# EAGLE design badge_buttons (EAGLE 9.0.1)
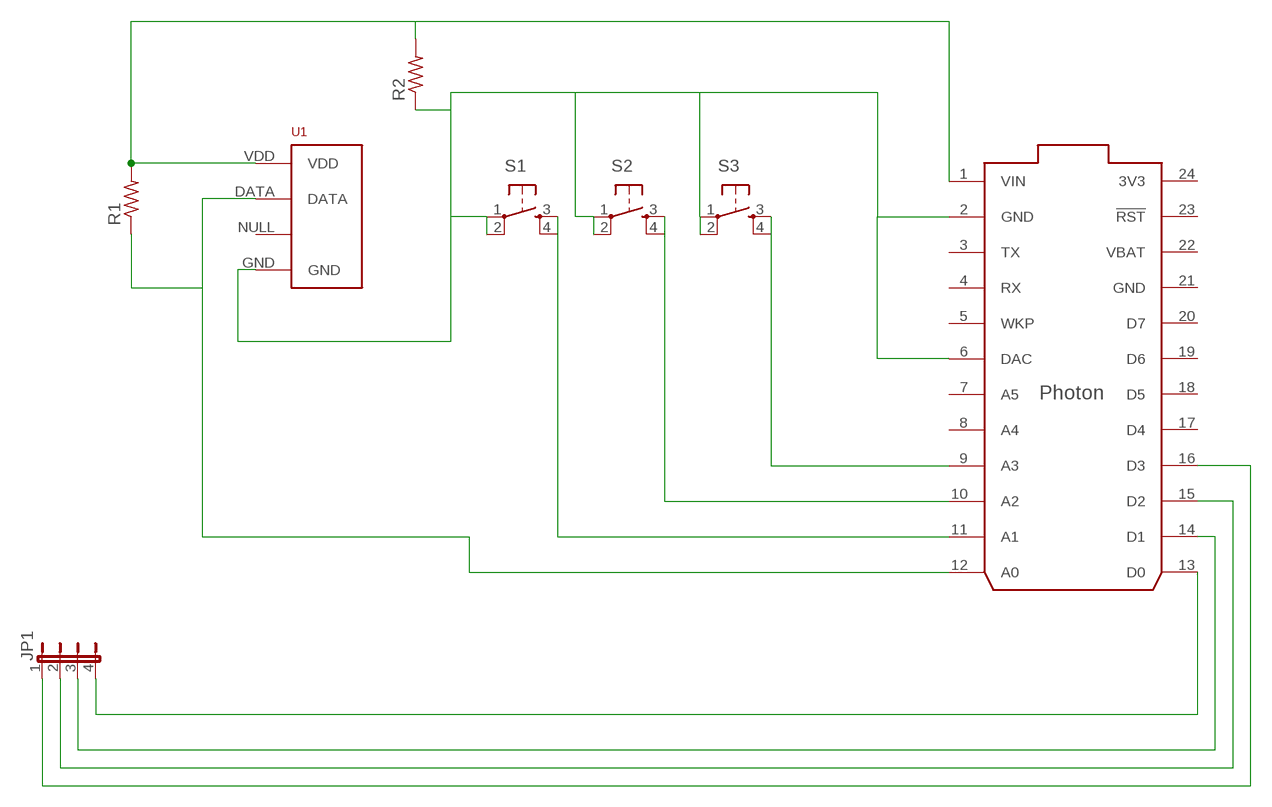
[diagram p0: schematic, sheet 1]

## Parts
JP1  JP4E  [JP4]
R1  R-US_0204/7  [0204/7]
R2  R-US_0204/7  [0204/7]
S1  TAC_SWITCHPTH  [TACTILE-PTH]
S2  TAC_SWITCHPTH  [TACTILE-PTH]
S3  TAC_SWITCHPTH  [TACTILE-PTH]
U1  RHT03_DHT-22_AM2302  [RHT03_DHT-22]
U$1  PHOTON_WITH_HEADERS  [PHOTON]

## Nets
N$1: S3.3 S3.4 U$1.9(A3)
N$2: S2.3 S2.4 U$1.10(A2)
N$3: S1.3 S1.4 U$1.11(A1)
N$4: R2.1 S1.1 S1.2 S2.1 S2.2 S3.1 S3.2 U1.GND U$1.2(GND) U$1.6(DAC)
N$5: R1.2 R2.2 U1.VDD U$1.1(VIN)
N$6: R1.1 U1.DATA U$1.12(A0)
N$7: JP1.4 U$1.13(D0)
N$8: JP1.3 U$1.14(D1)
N$9: JP1.2 U$1.15(D2)
N$10: JP1.1 U$1.16(D3)
Unconnected: U1.NULL U$1.3(TX) U$1.4(RX) U$1.5(WKP) U$1.7(A5) U$1.8(A4) U$1.17(D4) U$1.18(D5) U$1.19(D6) U$1.20(D7) U$1.23(!RST)

## Power pins joined to a net without a drawn wire
3V3: U$1.24(3V3)
GND: U$1.21(GND)
VBAT: U$1.22(VBAT)

## Library data of the parts
JP1 = jumper:JP4E: JUMPER
R1 R2 = resistor:R-US_: RESISTOR, American symbol
S1-S3 = SparkFun-Retired:TAC_SWITCH: Momentary Switch Button commonly used for reset or general input. Spark Fun Electronics SKU : COM-00097 SMT- SWCH-08247
U1 = RHT03_DHT-22_AM2302:RHT03_DHT-22_AM2302: RHT03 / DHT-22 / AM2302 Packages and symbol for the RHT03 / DHT-22 relative humidity and temperature sensor. Note: The AM2302 is a wired version of the DHT-22 which typically requires less clearance and is thus provided as a separate package.; PROD_ID: SEN-10167
U$1 = Particle-Devices:PHOTON: Particle Photon Wi-Fi through-hole development board footprint Product datasheet: here <https://docs.particle.io/datasheets/photon-(wifi)/photon-datasheet/> Design files: here <https://github.com/particle-iot/photon> Github : Particle devices library <https://github.com/particle-iot/hardware-libraries/tree/master/Eagle>

## Board
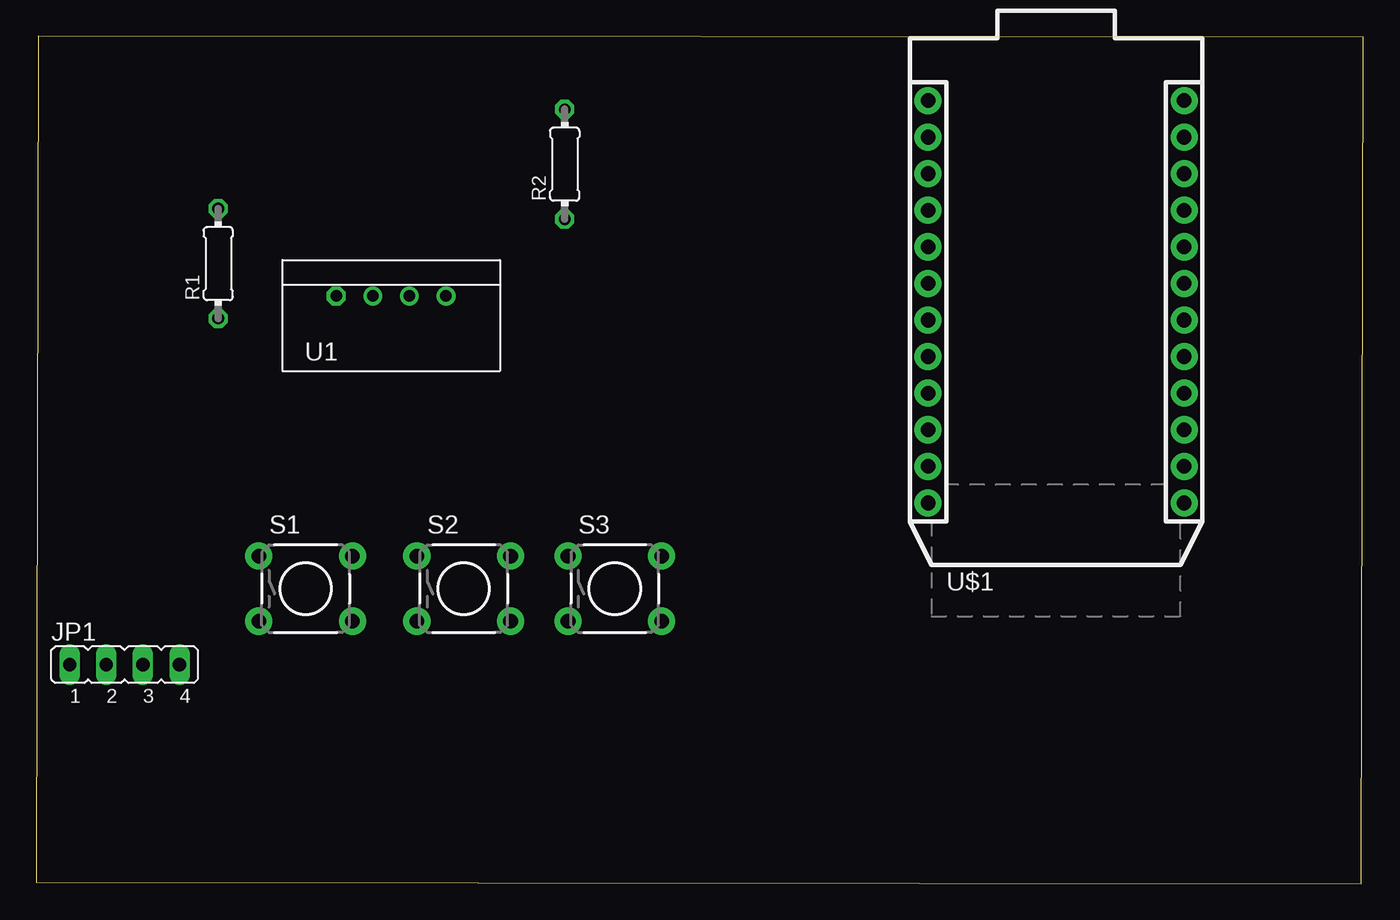
[diagram p1: board, top side]
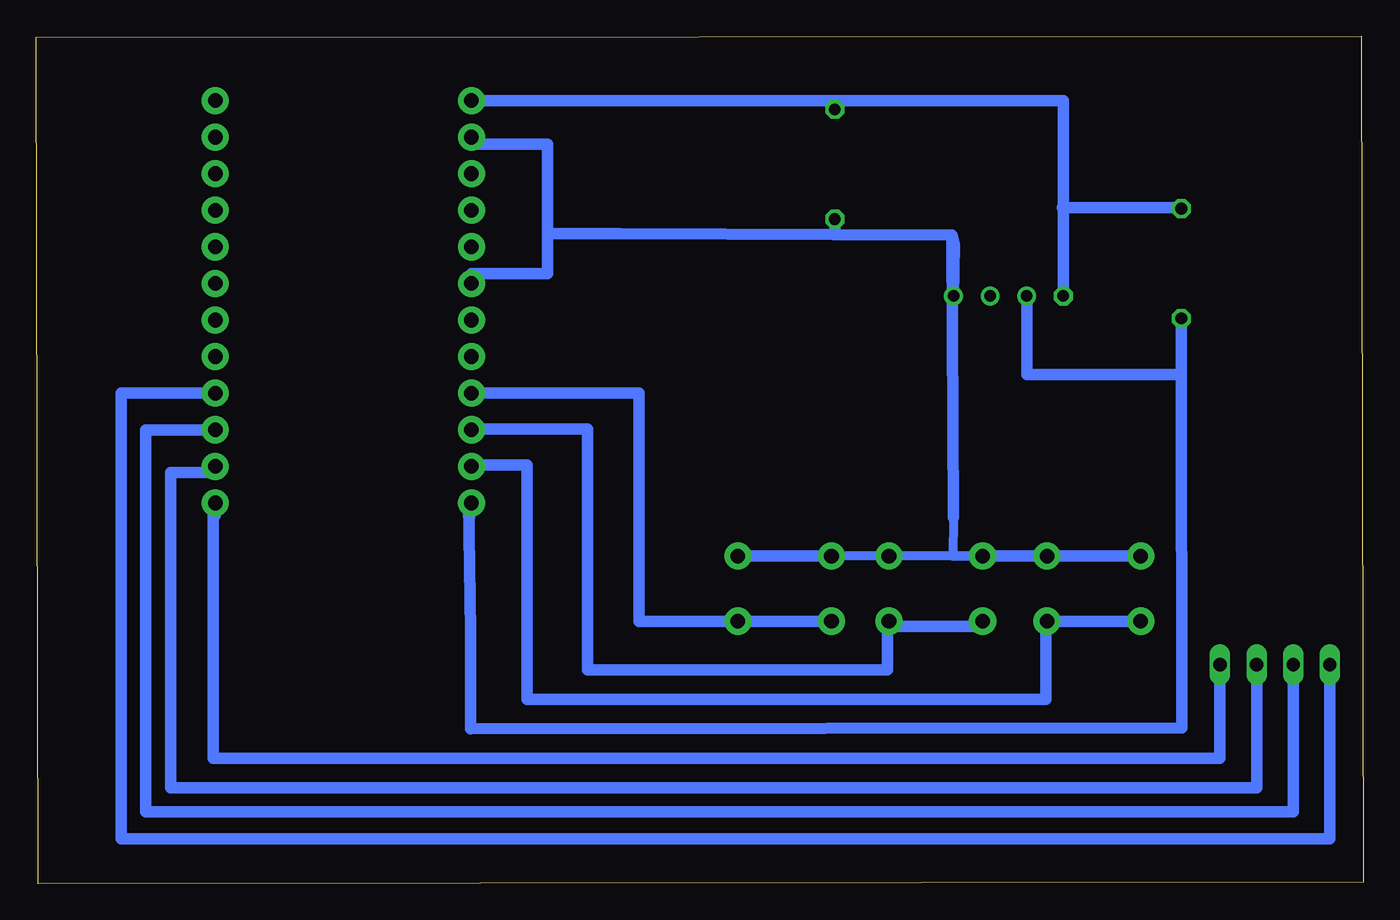
[diagram p2: board, bottom side, seen from below]

Size 92.15 x 58.85 mm. Coordinates in mm from the lower left corner, seen from the top.
Outline: 0,0.1 92,0 92.15,58.75 0.15,58.85 0,0.1
Copper layers (1*16): Top 0.035mm / dielectric 1.5mm / Bottom 0.035mm
Design rules "default": minimum track width 6mil, minimum drill 0.35mm, track to track 6mil, track to pad 6mil, pad to pad 6mil, via to via 6mil, smd to smd 6mil, copper to edge 40mil, drill to drill 6mil, minimum pad ring 10mil, minimum via ring 8mil, stop-mask expansion 4mil, vias tented up to drill 0mil, thermal gap 10mil

### Footprints (pad centres in the part's own frame; a part is rotated, then mirrored left to right if it is on the bottom)
JP4 = drill 0.914 long: 1 -3.81,0; 2 -1.27,0; 3 1.27,0; 4 3.81,0
0204/7 = drill 0.813 octagon: 1 -3.81,0; 2 3.81,0
TACTILE-PTH = drill 1.016 pad 1.88: 1 -3.251,2.261; 2 3.251,2.261; 3 -3.251,-2.261; 4 3.251,-2.261
RHT03_DHT-22 = drill 0.8: DATA -1.27,0; GND 3.81,0; NULL 1.27,0 | drill 0.8 octagon: VDD -3.81,0
PHOTON = drill 1.016 pad 1.88: 1 1.27,33.02; 2 1.27,30.48; 3 1.27,27.94; 4 1.27,25.4; 5 1.27,22.86; 6 1.27,20.32; 7 1.27,17.78; 8 1.27,15.24; 9 1.27,12.7; 10 1.27,10.16; 11 1.27,7.62; 12 1.27,5.08; 13 19.05,5.08; 14 19.05,7.62; 15 19.05,10.16; 16 19.05,12.7; 17 19.05,15.24; 18 19.05,17.78; 19 19.05,20.32; 20 19.05,22.86; 21 19.05,25.4; 22 19.05,27.94; 23 19.05,30.48; 24 19.05,33.02

### Placement (x,y rotation side)
JP1  6.15,15.2 0 top
R1  12.65,43.05 90 top
R2  36.7,49.95 90 top
S1  18.72,20.48 0 top
S2  29.69,20.48 0 top
S3  40.18,20.48 0 top
U1  24.65,40.8 0 top
U$1  60.65,21.35 0 top

### Tracks (layer width: path | path; a pad name or v marks a point on that pad's centre or on a via)
N$1
  Bottom 0.305: U$1.9 61.65,34.32 61.65,34.35
  Bottom 0.813: 50.3,18.22 43.8,18.22 S3.4 S3.3 | 50.3,18.22 50.3,18.2 | 50.3,18.22 50.3,34.05 U$1.9
N$2
  Bottom 0.813: S2.4 33.05,18.22 33.05,17.85 | 33.05,17.85 33.05,14.85 53.85,14.85 53.85,31.55 61.92,31.55 U$1.10 | S2.3 26.81,17.85 33.05,17.85
N$3
  Bottom 0.813: U$1.11 61.92,29.05 58.05,29.05 58.05,12.8 22.05,12.8 22.05,18.22 S1.4 S1.3
N$4
  Top 0.813: 15.4,22.74 S1.1
  Bottom 0.508: S2.1 26.65,22.74 | 33.05,22.65 33.04,22.74 | U$1.6 61.92,42.35
  Bottom 0.61: S3.1 33.04,22.74 S2.2 26.65,22.74 28.5,22.72 28.47,25.41 | U$1.2 61.92,51.35
  Bottom 0.813: S1.1 S1.2 S2.1 | S3.1 S3.2 | U1.GND 28.41,44.34 28.57,45.03 | 28.57,45.03 28.47,25.41 | 56.65,45.13 51.65,45.11 36.75,45.06 | 36.75,45.06 28.57,45.03 | 61.92,42.35 56.65,42.35 56.65,45.13 | 61.92,51.35 56.65,51.35 56.65,45.13 | R2.1 36.7,45.11 36.75,45.06
N$5
  Bottom 0.813: U1.VDD 20.84,46.95 | 20.84,46.95 20.9,46.95 | 20.84,46.95 12.65,46.95 R1.2 | 20.84,46.95 20.84,54.37 36.6,54.37 | 36.6,54.37 U$1.1 | R2.2 36.7,54.27 36.6,54.37
N$6
  Bottom 0.508: U$1.12 62.65,26.43 61.8,26.31 61.92,25.41 62.12,26.5
  Bottom 0.813: U1.DATA 23.38,35.35 12.65,35.35 | 12.65,35.35 12.6,10.8 62,10.75 62,17.5 62.12,26.5 | R1.1 12.65,35.35
N$7
  Bottom 0.813: JP1.4 9.96,8.7 79.85,8.7 79.85,25.57 79.7,25.57 U$1.13
N$8
  Bottom 0.813: JP1.3 7.42,6.65 82.8,6.65 82.8,28.55 79.7,28.55 U$1.14
N$9
  Bottom 0.813: JP1.2 4.88,5 84.55,5 84.55,31.51 U$1.15
N$10
  Bottom 0.813: JP1.1 2.34,3.1 86.25,3.1 86.25,34.05 U$1.16